# EAGLE schematic Rev2 Logicar (EAGLE 9.1.3)
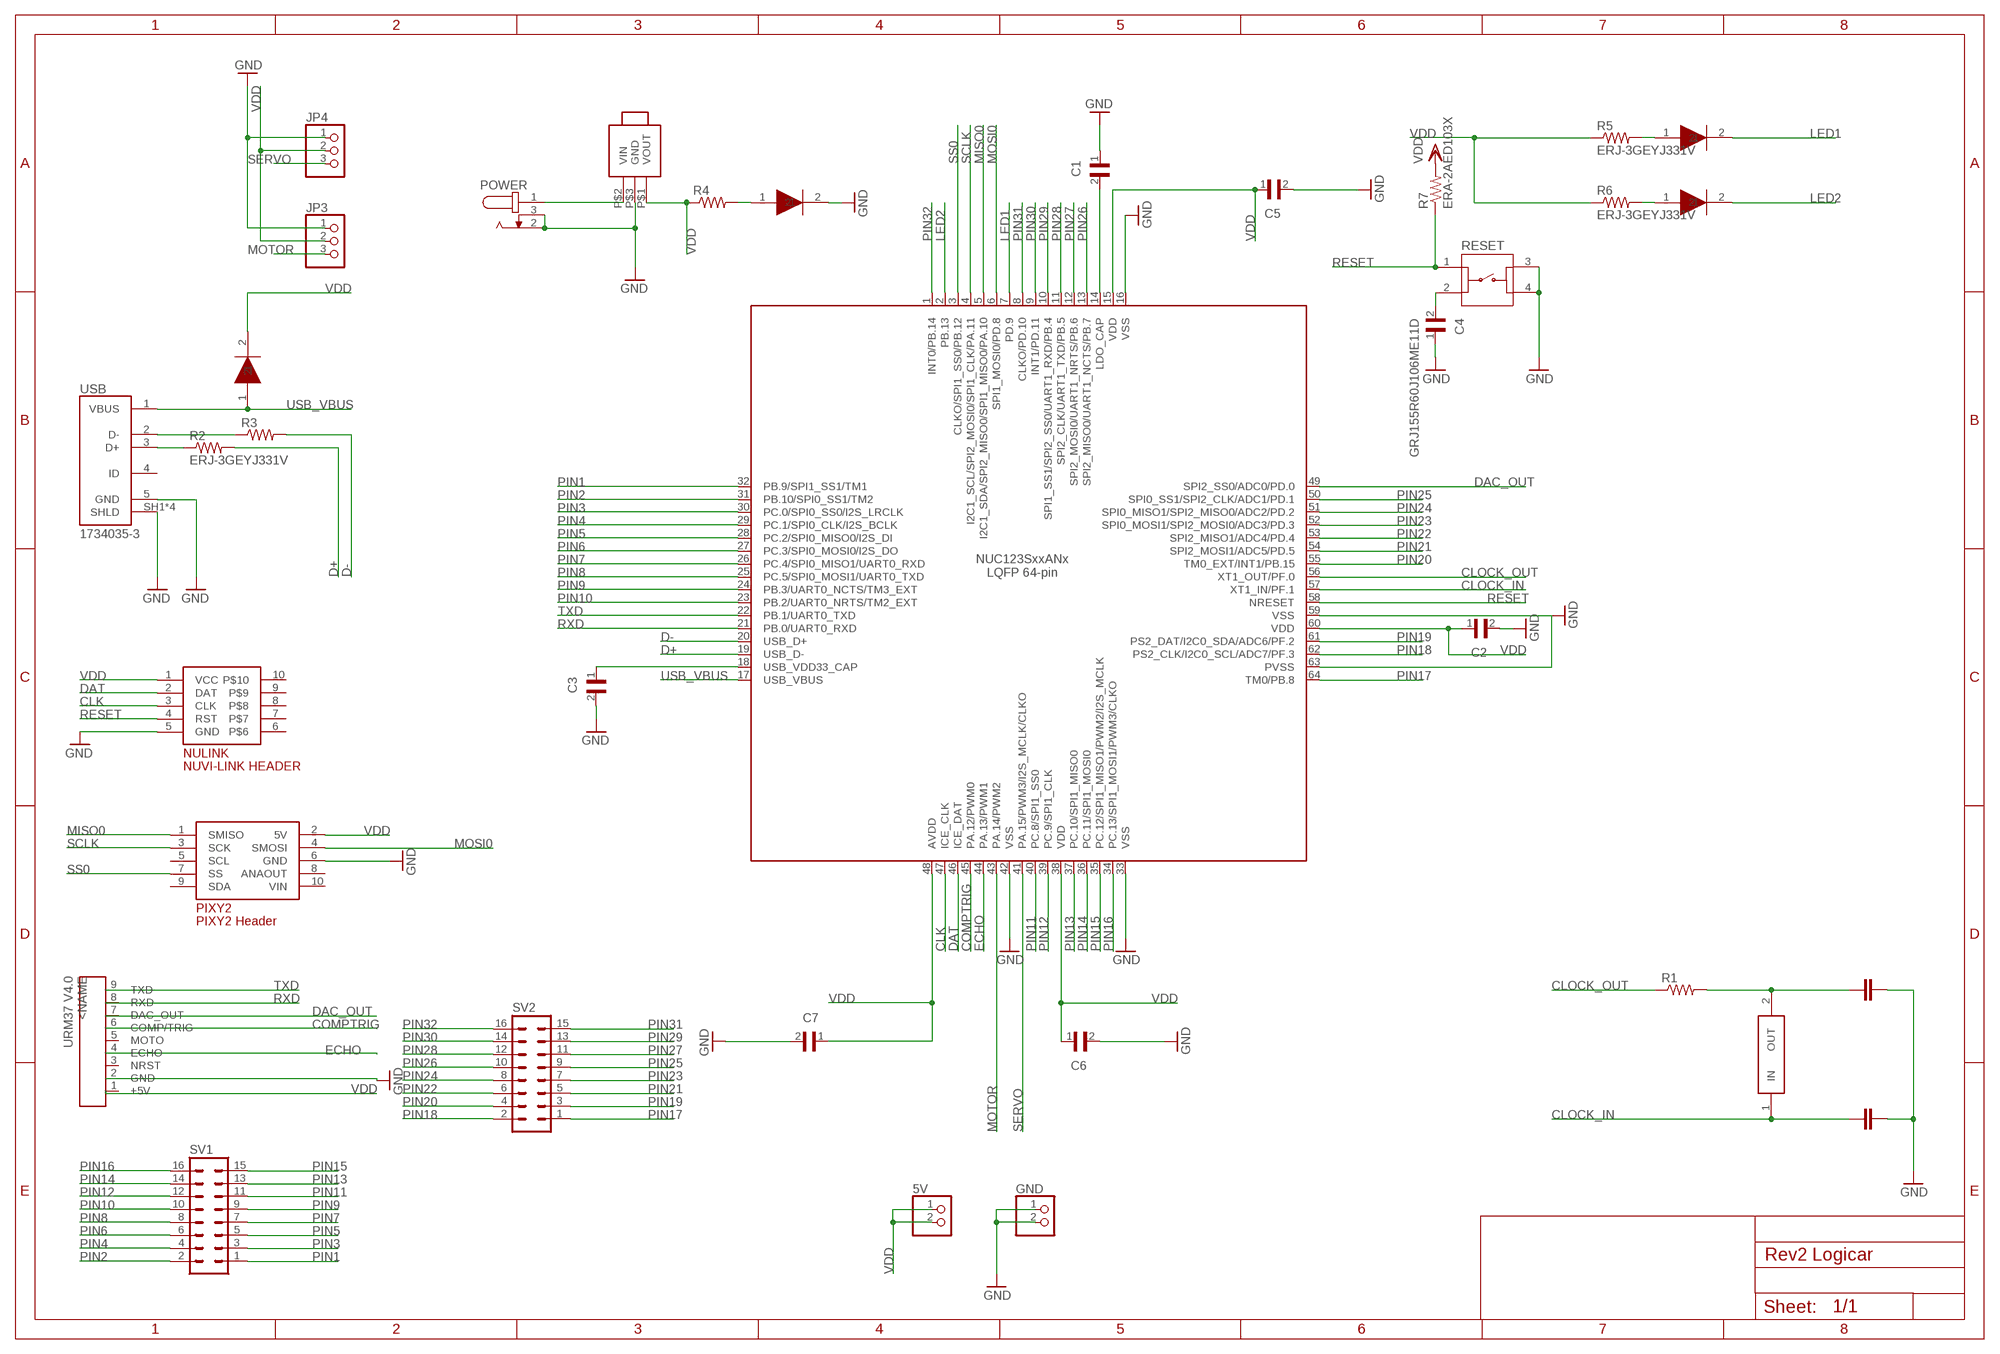
[diagram p0: schematic, sheet 1]

## Parts
5V  PINHD-1X2  [1X02]
18UF  18UF_CAPACITOR  [CAPC1608X70]
18UF1  18UF_CAPACITOR  [CAPC1608X70]
C1  F380J476MMAAXEH3  [CAPC1608X90]
C2  CL21F104ZBCNNNC  [CAPC2012X140N]
C3  CL21F104ZBCNNNC  [CAPC2012X140N]
C4  GRJ155R60J106ME11D  [CAPC1005X55N]
C5  CL21F104ZBCNNNC  [CAPC2012X140N]
C6  CL21F104ZBCNNNC  [CAPC2012X140N]
C7  CL21F104ZBCNNNC  [CAPC2012X140N]
GND  PINHD-1X2  [1X02]
JP3  PINHD-1X3  [1X03]
JP4  PINHD-1X3  [1X03]
LED1  LED  [LEDC2408X70]
LED2  LED  [LEDC2408X70]
NUC123  NUC123SD4AN0-ND  [QFP40P900X900X160-64]
NULINK  NUVI-LINK  [NUVI-LINK]
PIXY2  PIXY2HEADER  [PIXY2PIN]
POWER  PJ-202A  [CUI_PJ-202A]
PWR_LED  LED  [LEDC2408X70]
R1  ERJ-3GEYJ331V  [RESC1608X55]
R2  ERJ-3GEYJ331V  [RESC1608X55]
R3  ERJ-3GEYJ331V  [RESC1608X55]
R4  ERJ-3GEYJ331V  [RESC1608X55]
R5  ERJ-3GEYJ331V  [RESC1608X55]
R6  ERJ-3GEYJ331V  [RESC1608X55]
R7  ERA-2AED103X  [RESC1005X40]
RESET  1825910-6  [SW_1825910-6-4]
SV1  MA08-2  [MA08-2]
SV2  MA08-2  [MA08-2]
U$2  CRYSTAL_OSS  [XTAL1145X470X420]
U$8  NCP5501  [DPAK3]
ULTRASONIC  1X9PINROW_MALE  [HDRV9W64P254_1X9_1016X508X838B]
USB  1734035-3  [TE_1734035-3]
USB_LED  LED  [LEDC2408X70]

## Nets
CLK: NUC123.47(ICE_CLK) NULINK.3(CLK)
CLOCK_IN: 18UF.1 NUC123.57(XT1_IN/PF.1) U$2.1(IN)
CLOCK_OUT: NUC123.56(XT1_OUT/PF.0) R1.1
COMPTRIG: NUC123.45(PA.12/PWM0) ULTRASONIC.6(COMP/TRIG)
D+: NUC123.19(USB_D-) R2.2
D-: NUC123.20(USB_D+) R3.2
DAC_OUT: NUC123.49(SPI2_SS0/ADC0/PD.0) ULTRASONIC.7(DAC_OUT)
DAT: NUC123.46(ICE_DAT) NULINK.2(DAT)
ECHO: NUC123.44(PA.13/PWM1) ULTRASONIC.4(ECHO)
GND: 18UF1.2 18UF.2 C1.1 C2.2 C3.2 C4.1 C5.2 C6.2 C7.2 GND.1 GND.2 JP3.1 JP4.1 NUC123.16(VSS) NUC123.33(VSS) NUC123.42(VSS) NUC123.59(VSS) NUC123.63(PVSS) NULINK.5(GND) PIXY2.6(GND) POWER.2 POWER.3 PWR_LED.2 RESET.3 RESET.4 U$8.P$3(GND) ULTRASONIC.2(GND) USB.5(GND) USB.SH1(SHLD) USB.SH2(SHLD) USB.SH3(SHLD) USB.SH4(SHLD)
LED1: LED1.2 NUC123.7(PD.9)
LED2: LED2.2 NUC123.2(PB.13)
MISO0: NUC123.5(I2C1_SDA/SPI2_MISO0/SPI1_MISO0/PA.10) PIXY2.1(SMISO)
MOSI0: NUC123.6(SPI1_MOSI0/PD.8) PIXY2.4(SMOSI)
MOTOR: JP3.3 NUC123.43(PA.14/PWM2)
N$1: C3.1 NUC123.18(USB_VDD33_CAP)
N$2: C1.2 NUC123.14(LDO_CAP)
N$3: 18UF1.1 R1.2 U$2.2(OUT)
N$4: C4.2 RESET.2
N$5: R2.1 USB.3(D+)
N$6: R3.1 USB.2(D-)
N$7: PWR_LED.1 R4.2
N$8: POWER.1 U$8.P$2(VIN)
N$11: LED1.1 R5.2
N$12: LED2.1 R6.2
PIN1: NUC123.32(PB.9/SPI1_SS1/TM1) SV1.1
PIN2: NUC123.31(PB.10/SPI0_SS1/TM2) SV1.2
PIN3: NUC123.30(PC.0/SPI0_SS0/I2S_LRCLK) SV1.3
PIN4: NUC123.29(PC.1/SPI0_CLK/I2S_BCLK) SV1.4
PIN5: NUC123.28(PC.2/SPI0_MISO0/I2S_DI) SV1.5
PIN6: NUC123.27(PC.3/SPI0_MOSI0/I2S_DO) SV1.6
PIN7: NUC123.26(PC.4/SPI0_MISO1/UART0_RXD) SV1.7
PIN8: NUC123.25(PC.5/SPI0_MOSI1/UART0_TXD) SV1.8
PIN9: NUC123.24(PB.3/UART0_NCTS/TM3_EXT) SV1.9
PIN10: NUC123.23(PB.2/UART0_NRTS/TM2_EXT) SV1.10
PIN11: NUC123.40(PC.8/SPI1_SS0) SV1.11
PIN12: NUC123.39(PC.9/SPI1_CLK) SV1.12
PIN13: NUC123.37(PC.10/SPI1_MISO0) SV1.13
PIN14: NUC123.36(PC.11/SPI1_MOSI0) SV1.14
PIN15: NUC123.35(PC.12/SPI1_MISO1/PWM2/I2S_MCLK) SV1.15
PIN16: NUC123.34(PC.13/SPI1_MOSI1/PWM3/CLKO) SV1.16
PIN17: NUC123.64(TM0/PB.8) SV2.1
PIN18: NUC123.62(PS2_CLK/I2C0_SCL/ADC7/PF.3) SV2.2
PIN19: NUC123.61(PS2_DAT/I2C0_SDA/ADC6/PF.2) SV2.3
PIN20: NUC123.55(TM0_EXT/INT1/PB.15) SV2.4
PIN21: NUC123.54(SPI2_MOSI1/ADC5/PD.5) SV2.5
PIN22: NUC123.53(SPI2_MISO1/ADC4/PD.4) SV2.6
PIN23: NUC123.52(SPI0_MOSI1/SPI2_MOSI0/ADC3/PD.3) SV2.7
PIN24: NUC123.51(SPI0_MISO1/SPI2_MISO0/ADC2/PD.2) SV2.8
PIN25: NUC123.50(SPI0_SS1/SPI2_CLK/ADC1/PD.1) SV2.9
PIN26: NUC123.13(SPI2_MISO0/UART1_NCTS/PB.7) SV2.10
PIN27: NUC123.12(SPI2_MOSI0/UART1_NRTS/PB.6) SV2.11
PIN28: NUC123.11(SPI2_CLK/UART1_TXD/PB.5) SV2.12
PIN29: NUC123.10(SPI1_SS1/SPI2_SS0/UART1_RXD/PB.4) SV2.13
PIN30: NUC123.9(INT1/PD.11) SV2.14
PIN31: NUC123.8(CLKO/PD.10) SV2.15
PIN32: NUC123.1(INT0/PB.14) SV2.16
RESET: NUC123.58(NRESET) NULINK.4(RST) R7.1 RESET.1
RXD: NUC123.21(PB.0/UART0_RXD) ULTRASONIC.8(RXD)
SCLK: NUC123.4(I2C1_SCL/SPI2_MOSI0/SPI1_CLK/PA.11) PIXY2.3(SCK)
SERVO: JP4.3 NUC123.41(PA.15/PWM3/I2S_MCLK/CLKO)
SS0: NUC123.3(CLKO/SPI1_SS0/PB.12) PIXY2.7(SS)
TXD: NUC123.22(PB.1/UART0_TXD) ULTRASONIC.9(TXD)
USB_VBUS: NUC123.17(USB_VBUS) USB.1(VBUS) USB_LED.1
VDD: 5V.1 5V.2 C2.1 C5.1 C6.1 C7.1 JP3.2 JP4.2 NUC123.15(VDD) NUC123.38(VDD) NUC123.48(AVDD) NUC123.60(VDD) NULINK.1(VCC) PIXY2.2(5V) R4.1 R5.1 R6.1 R7.2 U$8.P$1(VOUT) ULTRASONIC.1(+5V) USB_LED.2
Unconnected: NULINK.6 NULINK.7 NULINK.8 NULINK.9 NULINK.10 PIXY2.5(SCL) PIXY2.8(ANAOUT) PIXY2.9(SDA) PIXY2.10(VIN) ULTRASONIC.3(NRST) ULTRASONIC.5(MOTO) USB.4(ID)

## Library data of the parts
5V GND = pinhead:PINHD-1X2: PIN HEADER
18UF 18UF1 = Logicar Rev 2 Lib:18UF_CAPACITOR
C1 = Logicar Rev 2 Lib:F380J476MMAAXEH3: 47UF 6.3V 20% ESR300 1608-09; DESCRIPTION: Cap Tant Solid 47uF 6.3V M CASE 20% _1.6 X 0.85 X 0.8mm_ SMD 1608-09 0.3 Ohm 105°C T/R; MF: AVX; MP: F380J476MMAAXEH3; PACKAGE: 0603 AVX
C2 C3 C5-C7 = Logicar Rev 2 Lib:CL21F104ZBCNNNC: CAP CER 0.1UF 50V Y5V0805; DESCRIPTION: CL21 Series 0.1uF 50 V -20/+80% Tolerance Y5V SMT Multilayer Ceramic Capacitor; DIGI-KEY_PART_NUMBER: 1276-1007-1-ND; DIGI-KEY_PURCHASE_URL: https://www.digikey.com/product-detail/en/samsung-electro-mechanics/CL21F104ZBCNNNC/1276-1007-1-ND/3889093?utm_source=snapeda&utm_medium=aggregator&utm_campaign=symbol; MF: Samsung Electro-Mechanics; MP: CL21F104ZBCNNNC; PACKAGE: 0805 Samsung
C4 = Logicar Rev 2 Lib:GRJ155R60J106ME11D: CAPACITOR CERAMIC MLCC 0402 10UF 6.3V SMD; DESCRIPTION: Capacitor Ceramic Mlcc 0402 10uf 6.3v Smd; DIGI-KEY_PART_NUMBER: 490-13211-1-ND; DIGI-KEY_PURCHASE_URL: https://www.digikey.com/product-detail/en/murata-electronics-north-america/GRJ155R60J106ME11D/490-13211-1-ND/5877419?utm_source=snapeda&utm_medium=aggregator&utm_campaign=symbol; MF: Murata; MP: GRJ155R60J106ME11D; PACKAGE: 0402 Murata
JP3 JP4 = pinhead:PINHD-1X3: PIN HEADER
LED1 LED2 PWR_LED USB_LED = Logicar Rev 2 Lib:LED
NUC123 = Logicar Rev 2 Lib:NUC123SD4AN0-ND
NULINK = Logicar Rev 2 Lib:NUVI-LINK
PIXY2 = Logicar Rev 2 Lib:PIXY2HEADER
POWER = Logicar Rev 2 Lib:PJ-202A: 2.0 mm Center Pin, 2.5 A, Right Angle, Through Hole, Kinked Pins, Dc Power Jack Connector; CUI_PURCHASE_URL: https://www.cui.com/product/interconnect/dc-power-connectors/jacks/2.0-mm-center-pin/pj-202a?utm_source=snapeda.com&utm_medium=referral&utm_campaign=snapedaBOM; DESCRIPTION: 2.0 mm Center Pin, 2.5 A, Right Angle, Through Hole, Kinked Pins, Dc Power Jack Connector; DIGI-KEY_PART_NUMBER: CP-202A-ND; DIGI-KEY_PURCHASE_URL: https://www.digikey.com/product-detail/en/cui-inc/PJ-202A/CP-202A-ND/252007?utm_source=snapeda&utm_medium=aggregator&utm_campaign=symbol; MF: CUI Inc.; MP: PJ-202A; PACKAGE: None
R1-R6 = Logicar Rev 2 Lib:ERJ-3GEYJ331V: Res Thick Film 0603 330 Ohm 5% 1/10W ±200ppm/°C Molded SMD Punched Carrier T/R; DESCRIPTION: Res Thick Film 0603 330 Ohm 5% 0.1W_1/10W_ ?200ppm/C Molded SMD Automotive Punched T/R; DIGI-KEY_PART_NUMBER: P330GCT-ND; DIGI-KEY_PURCHASE_URL: https://www.digikey.com/product-detail/en/panasonic-electronic-components/ERJ-3GEYJ331V/P330GCT-ND/134778?utm_source=snapeda&utm_medium=aggregator&utm_campaign=symbol; MF: Panasonic; MP: ERJ-3GEYJ331V; PACKAGE: 0603 Panasonic
R7 = Logicar Rev 2 Lib:ERA-2AED103X: RES SMD 10K OHM 0.5% 1/16W 0402; DESCRIPTION: Res Thin Film 0402 10K Ohm 0.5% 0.063W_1/16W_ }25ppm/C Molded SMD Automotive Punched T/R; DIGI-KEY_PART_NUMBER: P10KDECT-ND; DIGI-KEY_PURCHASE_URL: https://www.digikey.com/product-detail/en/panasonic-electronic-components/ERA-2AED103X/P10KDECT-ND/1706304?utm_source=snapeda&utm_medium=aggregator&utm_campaign=symbol; MF: Panasonic; MP: ERA-2AED103X; PACKAGE: 0402 Panasonic
RESET = Logicar Rev 2 Lib:1825910-6: Switch Tactile OFF (ON) SPST Round Button PC Pins 0.05A 24VDC 100000Cycles 1.57N Thru-Hole Loose; COMMENT: 1825910-6; DESCRIPTION: Switch Push Button OFF _ON_ SPST Round Button 0.05A 24VDC Momentary Contact PC Pins Thru-Hole; DIGI-KEY_PART_NUMBER: 450-1650-ND; DIGI-KEY_PURCHASE_URL: https://www.digikey.com/product-detail/en/te-connectivity-alcoswitch-switches/1825910-6/450-1650-ND/1632536?utm_source=snapeda&utm_medium=aggregator&utm_campaign=symbol; MF: TE Connectivity; MP: 1825910-6; PACKAGE: None; TE_PURCHASE_URL: https://www.te.com/usa-en/product-1825910-6.html?te_bu=Cor&te_type=disp&te_campaign=seda_glo_cor-seda-global-disp-prtnr-fy19-seda-model-bom-cta_sma-317_1&elqCampaignId=32493
SV1 SV2 = con-lstb:MA08-2: PIN HEADER; OC_FARNELL: unknown; OC_NEWARK: unknown
U$2 = Logicar Rev 2 Lib:CRYSTAL_OSS
U$8 = Logicar Rev 2 Lib:NCP5501
ULTRASONIC = Logicar Rev 2 Lib:1X9PINROW_MALE
USB = Logicar Rev 2 Lib:1734035-3: Conn Mini USB 2.0 Type B RCP 5 POS 0.8mm Solder RA SMD 5 Terminal 1 Port T/R; COMMENT: 1734035-3; DESCRIPTION: Conn Mini USB 2.0 Type B RCP 5 POS 0.8mm Solder RA SMD 5 Terminal 1 Port T/R; DIGI-KEY_PART_NUMBER: A121553CT-ND; DIGI-KEY_PURCHASE_URL: https://www.digikey.com/product-detail/en/te-connectivity-amp-connectors/1734035-3/A121553CT-ND/5246532?utm_source=snapeda&utm_medium=aggregator&utm_campaign=symbol; EU_ROHS_COMPLIANCE: Compliant; MF: TE Connectivity; MP: 1734035-3; PACKAGE: None; TE_PURCHASE_URL: https://www.te.com/usa-en/product-1734035-3.html?te_bu=Cor&te_type=disp&te_campaign=seda_glo_cor-seda-global-disp-prtnr-fy19-seda-model-bom-cta_sma-317_1&elqCampaignId=32493